# Altium schematic sheet BrauV2_AnalogueInput.SchDoc
size 420 x 297 mm; PageSetup: Record=PageOptions|CenterHorizontal=True|CenterVertical=True|PrintScale=1.01|XCorrection=1.00|YCorrection=1.00|PrintKind=1|BorderSize=5000000|LeftOffset=0|BottomOffset=0|Orientation=2|PaperLength=1000|PaperWidth=1000|Scale=100|PaperSource=7|PrintQuality=-4|MediaType=1|DitherType=10|PaperKind=A3|PrintScaleMode=1; DocumentNumber: 5; SheetNumber: 5; SheetTotal: 22
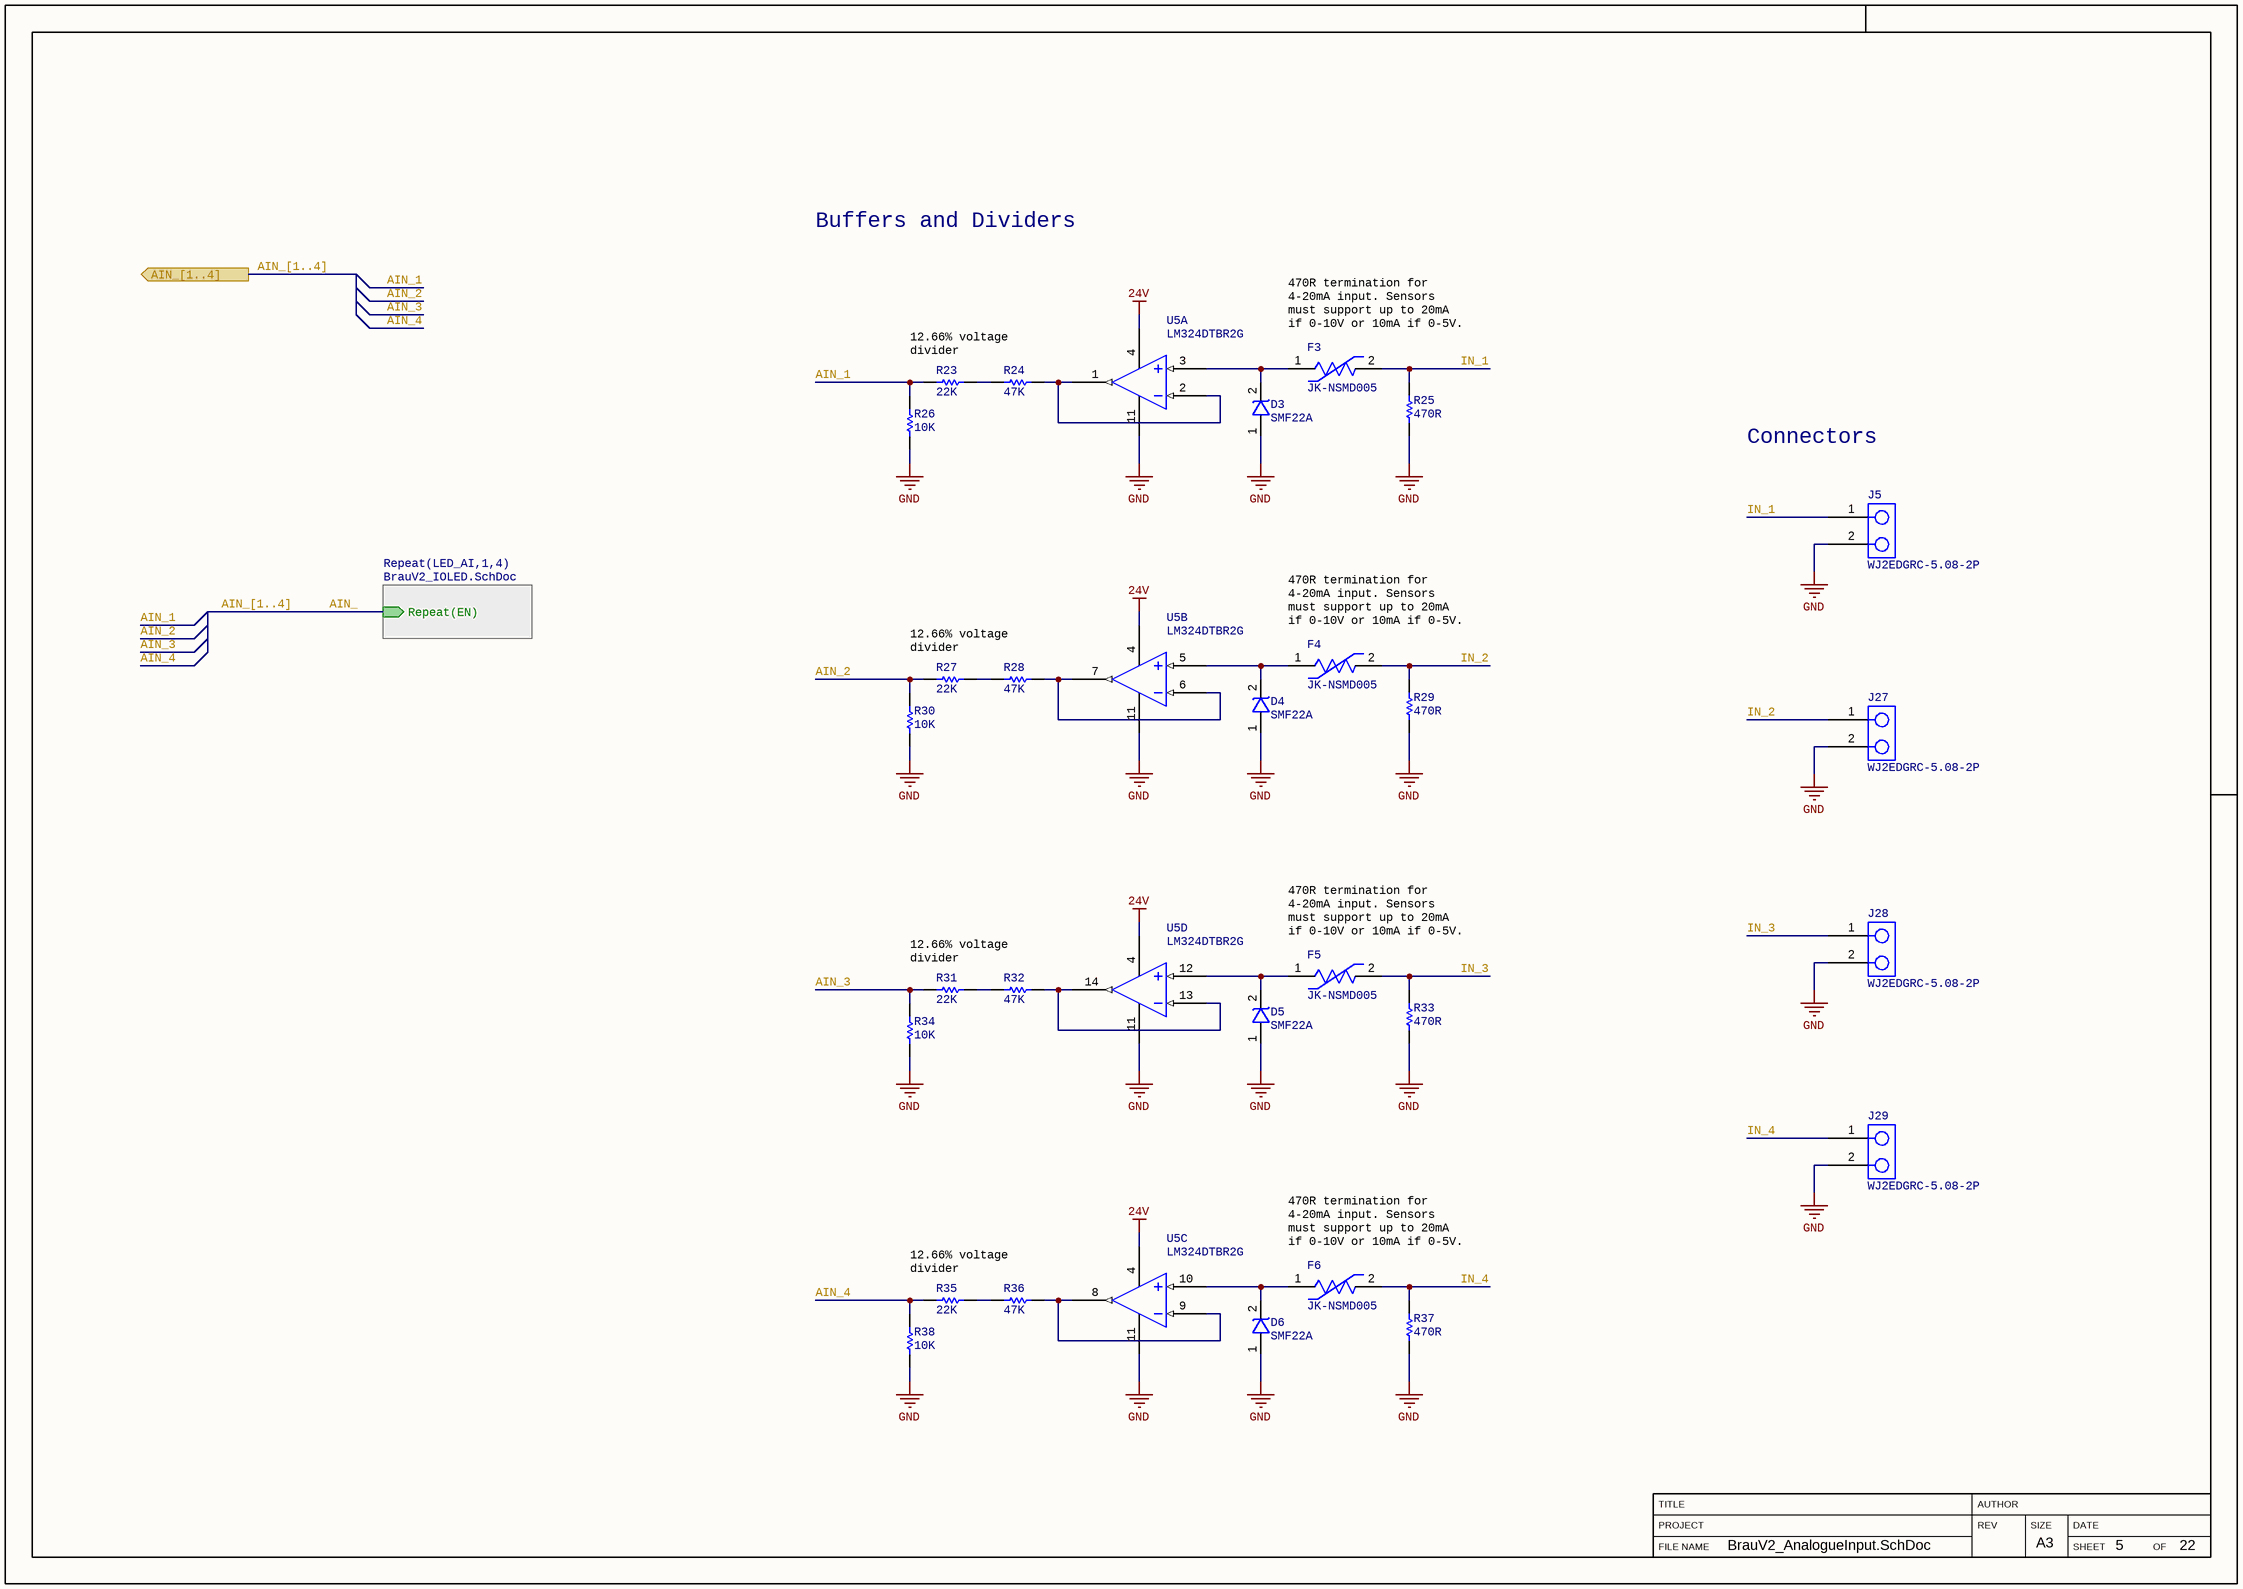
[diagram p0: BrauV2_AnalogueInput.SchDoc]

## Parts
D3  SMF22A  [SOD-123FL]
D4  SMF22A  [SOD-123FL]
D5  SMF22A  [SOD-123FL]
D6  SMF22A  [SOD-123FL]
F3  JK-NSMD005  [SMD_RES_1206(3216)_N]
F4  JK-NSMD005  [SMD_RES_1206(3216)_N]
F5  JK-NSMD005  [SMD_RES_1206(3216)_N]
F6  JK-NSMD005  [SMD_RES_1206(3216)_N]
J5  WJ2EDGRC-5.08-2P  [796638-2]
J27  WJ2EDGRC-5.08-2P  [796638-2]
J28  WJ2EDGRC-5.08-2P  [796638-2]
J29  WJ2EDGRC-5.08-2P  [796638-2]
R23  Resistance: 22K  [SMD_RES_0402(1005)_N]  (hidden comment: RC0402FR-0722KL)
R24  Resistance: 47K  [SMD_RES_0402(1005)_N]  (hidden comment: RC0402FR-0747KL)
R25  Resistance: 470R  [SMD_RES_2512(6432)_N]  (hidden comment: AC2512FK-07470RL)
R26  Resistance: 10K  [SMD_RES_0402(1005)_N]  (hidden comment: RC0402FR-0710KL)
R27  Resistance: 22K  [SMD_RES_0402(1005)_N]  (hidden comment: RC0402FR-0722KL)
R28  Resistance: 47K  [SMD_RES_0402(1005)_N]  (hidden comment: RC0402FR-0747KL)
R29  Resistance: 470R  [SMD_RES_2512(6432)_N]  (hidden comment: AC2512FK-07470RL)
R30  Resistance: 10K  [SMD_RES_0402(1005)_N]  (hidden comment: RC0402FR-0710KL)
R31  Resistance: 22K  [SMD_RES_0402(1005)_N]  (hidden comment: RC0402FR-0722KL)
R32  Resistance: 47K  [SMD_RES_0402(1005)_N]  (hidden comment: RC0402FR-0747KL)
R33  Resistance: 470R  [SMD_RES_2512(6432)_N]  (hidden comment: AC2512FK-07470RL)
R34  Resistance: 10K  [SMD_RES_0402(1005)_N]  (hidden comment: RC0402FR-0710KL)
R35  Resistance: 22K  [SMD_RES_0402(1005)_N]  (hidden comment: RC0402FR-0722KL)
R36  Resistance: 47K  [SMD_RES_0402(1005)_N]  (hidden comment: RC0402FR-0747KL)
R37  Resistance: 470R  [SMD_RES_2512(6432)_N]  (hidden comment: AC2512FK-07470RL)
R38  Resistance: 10K  [SMD_RES_0402(1005)_N]  (hidden comment: RC0402FR-0710KL)
U5  LM324DTBR2G  [TSSOP-14]  (parts A,B,C,D of 4)

## Sub-sheets
Repeat(LED_AI,1,4) = BrauV2_IOLED.SchDoc: Repeat(EN) (in)

## Ports
AIN_[1..4] (out)

## Nets
24V: U5.4(VDD)
GND: D3.1(ANODE) D4.1(ANODE) D5.1(ANODE) D6.1(ANODE) J5.2 J27.2 J28.2 J29.2 R25.1 R26.2 R29.1 R30.2 R33.1 R34.2 R37.1 R38.2 U5.11(VSS)
AIN_: sheet Repeat(LED_AI,1,4)/Repeat(EN)
AIN_1: R23.1 R26.1
AIN_2: R27.1 R30.1
AIN_3: R31.1 R34.1
AIN_4: R35.1 R38.1
IN_1: F3.2 J5.1 R25.2
IN_2: F4.2 J27.1 R29.2
IN_3: F5.2 J28.1 R33.2
IN_4: F6.2 J29.1 R37.2
NetD3_2: D3.2(CATHODE) F3.1 U5.3(VIN+)
NetD4_2: D4.2(CATHODE) F4.1 U5.5(VIN+)
NetD5_2: D5.2(CATHODE) F5.1 U5.12(VIN+)
NetD6_2: D6.2(CATHODE) F6.1 U5.10(VIN+)
NetR23_2: R23.2 R24.2
NetR24_1: R24.1 U5.1(VOUT) U5.2(VIN-)
NetR27_2: R27.2 R28.2
NetR28_1: R28.1 U5.6(VIN-) U5.7(VOUT)
NetR31_2: R31.2 R32.2
NetR32_1: R32.1 U5.13(VIN-) U5.14(VOUT)
NetR35_2: R35.2 R36.2
NetR36_1: R36.1 U5.8(VOUT) U5.9(VIN-)

## Buses and harness runs
bus AIN_[1..4]
bus AIN_[1..4] = port AIN_[1..4]

## Notes on the sheet
- Buffers and Dividers
- (near F3) 470R termination for 4-20mA input. Sensors must support up to 20mA if 0-10V or 10mA if 0-5V.
- 12.66% voltage divider
- Connectors
- (near F4) 470R termination for 4-20mA input. Sensors must support up to 20mA if 0-10V or 10mA if 0-5V.
- (near F5) 470R termination for 4-20mA input. Sensors must support up to 20mA if 0-10V or 10mA if 0-5V.
- (near F6) 470R termination for 4-20mA input. Sensors must support up to 20mA if 0-10V or 10mA if 0-5V.
- FILE NAME
- PROJECT
- TITLE
- REV
- AUTHOR
- SIZE
- SHEET
- DATE
- OF
- A3

## Library data of the parts
D3-D6 = SMF22A: Unidirectional 22V 24.4V 35.5V 5.6A SOD-123F TVS RoHS
F3-F6 = JK-NSMD005: 60V 150mA 1.5s 1206 PTC Resettable Fuses RoHS
J5 J27-J29 = WJ2EDGRC-5.08-2P: Covered（4Sided） 2 1 0.200"（5.08mm） 2 P=5.08mm Pluggable System Terminal Block RoHS
R23 R27 R31 R35 = 22K 0402 1% 1/16W: 22kΩ ±1% 1/16W ±100ppm/℃ 0402 Chip Resistor - Surface Mount RoHS; Package: 0402; Tolerance: 1%; Power Rating: 1/16W
R24 R28 R32 R36 = 47K 0402 1% 1/16W: 47kΩ ±1% 1/16W ±100ppm/℃ 0402 Chip Resistor - Surface Mount RoHS; Package: 0402; Tolerance: 1%; Power Rating: 1/16W
R25 R29 R33 R37 = 470R 2512 1% 1W: 470Ω ±1% 1W ±100ppm/℃ 2512 Chip Resistor - Surface Mount RoHS; Package: 2512; Tolerance: 1%; Power Rating: 1W
R26 R30 R34 R38 = 10K 0402 1% 1/16W: 10kΩ ±1% 1/16W ±100ppm/℃ 0402 Chip Resistor - Surface Mount RoHS; Package: 0402; Tolerance: 1%; Power Rating: 1/16W
U5 = LM324DTBR2G: General Purpose 4 3V ~ 32V, ±1.5V ~ 16V 1MHz 0.6 V/us TSSOP-14 Operational Amplifiers RoHS